# EAGLE design thermostat (EAGLE 7.6.0)
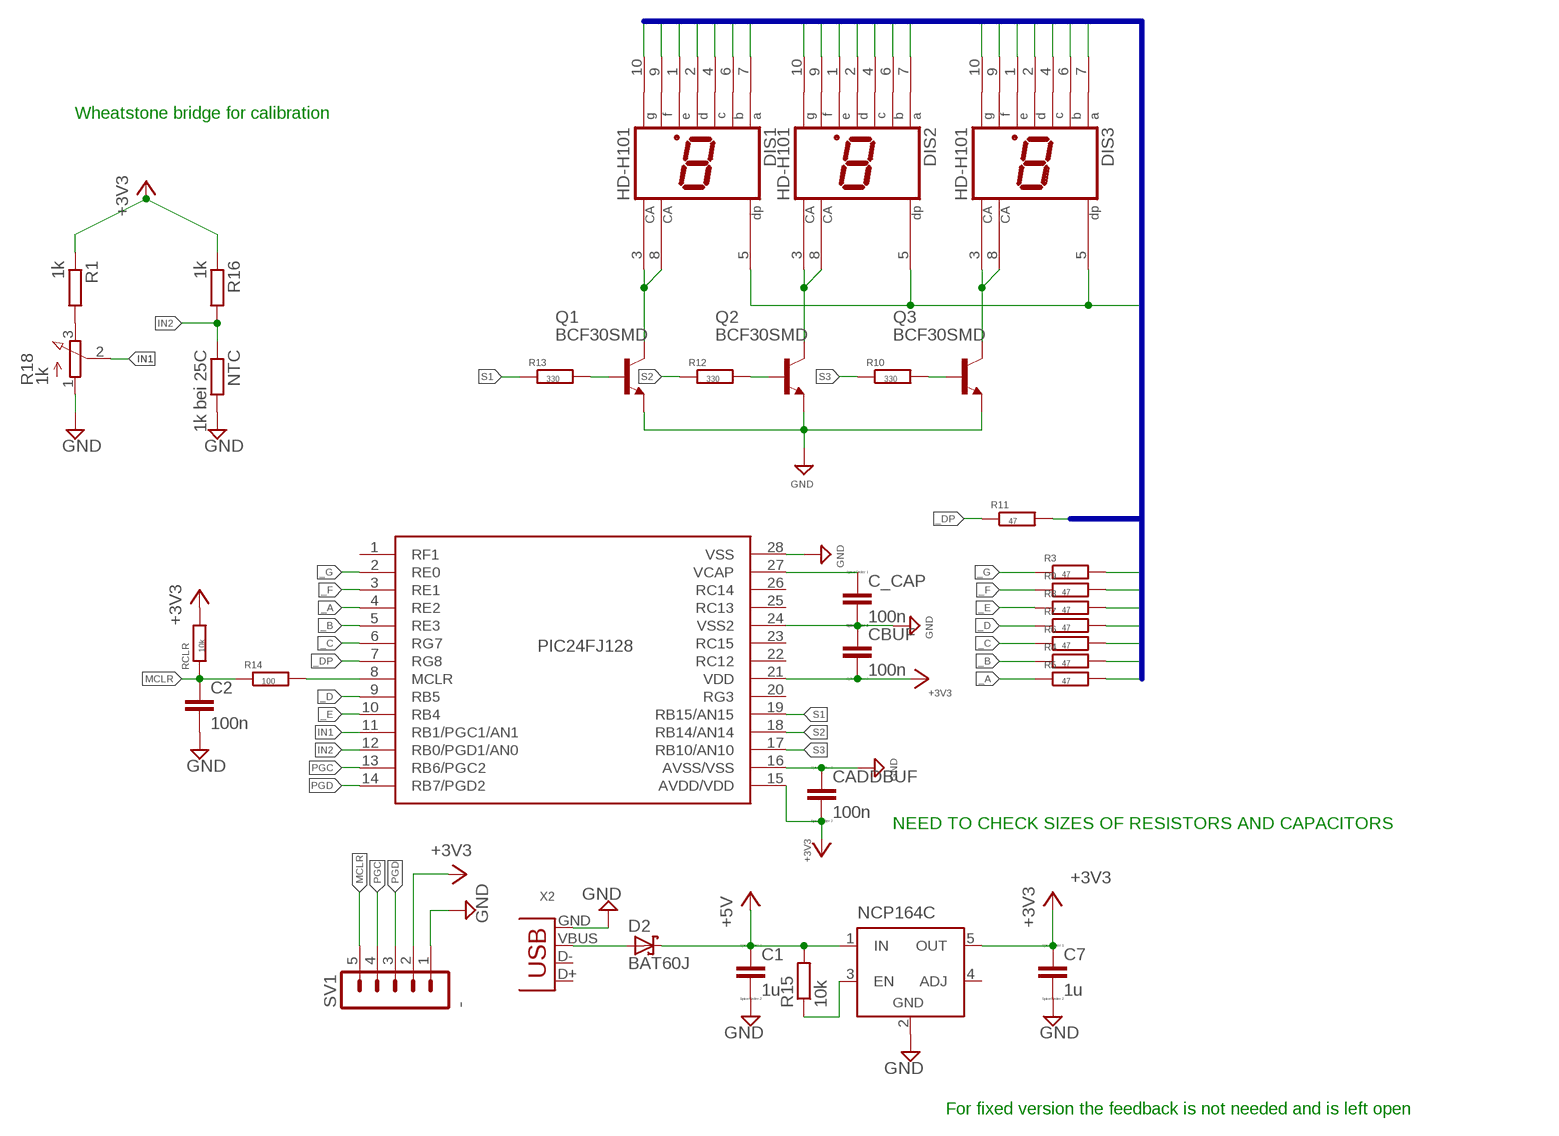
[diagram p0: schematic, sheet 1]

## Parts
C1  1u  CC0603  [C0603]
C2  100n  C-EUC0805  [C0805]
C7  1u  CC0603  [C0603]
C_CAP  100n  CC0603  [C0603]
CADDBUF  100n  CC0603  [C0603]
CBUF  100n  CC0603  [C0603]
D2  BAT60J  [SOD323_ST]
DIS1  HD-H101  [HDSP-M]
DIS2  HD-H101  [HDSP-M]
DIS3  HD-H101  [HDSP-M]
NCP164C  -  NCP164C-5V-3.3V  [TSOP-5]
NTC  1k bei 25C  R-EU_0204/2V  [0204V]
Q1  BCF30SMD  [SOT23-BEC]
Q2  BCF30SMD  [SOT23-BEC]
Q3  BCF30SMD  [SOT23-BEC]
R1  1k  R-EU_R2010  [R2010]
R3  47  R-EU_R0603  [R0603]
R4  47  R-EU_R0603  [R0603]
R5  47  R-EU_R0603  [R0603]
R6  47  R-EU_R0603  [R0603]
R7  47  R-EU_R0603  [R0603]
R8  47  R-EU_R0603  [R0603]
R9  47  R-EU_R0603  [R0603]
R10  330  R-EU_R0603  [R0603]
R11  47  R-EU_R0603  [R0603]
R12  330  R-EU_R0603  [R0603]
R13  330  R-EU_R0603  [R0603]
R14  100  R-EU_R0603  [R0603]
R15  10k  R-EU_R0603  [R0603]
R16  1k  R-EU_R2010  [R2010]
R18  1k  3RP/1610N  [3RP/1610N]
RCLR  10k  R-EU_R0603  [R0603]
SV1  -  MA05-1  [MA05-1]
U$2  -  PIC24FJ128  [SSOP28]
X2  -  USB-A-S  [USB-A-S]

## Nets
+3V3: C7.1 CADDBUF.2 CBUF.2 NCP164C.5(OUT) R1.1 R16.1 RCLR.2 SV1.2 U$2.15(AVDD/VDD) U$2.21(VDD)
+5V: C1.1 D2.C NCP164C.1(IN) R15.2
_A: R5.1 U$2.4(RE2)
_B: R4.1 U$2.5(RE3)
_C: R6.1 U$2.6(RG7)
_D: R7.1 U$2.9(RB5)
_DP: R11.1 U$2.7(RG8)
_E: R8.1 U$2.10(RB4)
_F: R9.1 U$2.3(RE1)
_G: R3.1 U$2.2(RE0)
A: DIS1.7(A) DIS2.7(A) DIS3.7(A) R5.2
B: DIS1.6(B) DIS2.6(B) DIS3.6(B) R4.2
C: DIS1.4(C) DIS2.4(C) DIS3.4(C) R6.2
D: DIS1.2(D) DIS2.2(D) DIS3.2(D) R7.2
DP: DIS1.5(DP) DIS2.5(DP) DIS3.5(DP) R11.2
E: DIS1.1(E) DIS2.1(E) DIS3.1(E) R8.2
F: DIS1.9(F) DIS2.9(F) DIS3.9(F) R9.2
G: DIS1.10(G) DIS2.10(G) DIS3.10(G) R3.2
GND: C1.2 C2.2 C7.2 C_CAP.2 CADDBUF.1 CBUF.1 NCP164C.2(GND) NTC.2 Q1.E Q2.E Q3.E R18.1(A) SV1.1 U$2.16(AVSS/VSS) U$2.24(VSS2) U$2.28(VSS) X2.GND
IN1: R18.2(S) U$2.11(RB1/PGC1/AN1)
IN2: NTC.1 R16.2 U$2.12(RB0/PGD1/AN0)
MCLR: C2.1 R14.1 RCLR.1 SV1.5
N$1: NCP164C.3(EN) R15.1
N$2: R1.2 R18.3(E)
N$4: C_CAP.1 U$2.27(VCAP)
N$6: D2.A X2.VBUS
N$8: R14.2 U$2.8(MCLR)
N$16: DIS1.3(CA) DIS1.8(CA) Q1.C
N$17: DIS2.3(CA) DIS2.8(CA) Q2.C
N$18: DIS3.3(CA) DIS3.8(CA) Q3.C
N$19: Q1.B R13.2
N$20: Q2.B R12.2
N$21: Q3.B R10.2
PGC: SV1.4 U$2.13(RB6/PGC2)
PGD: SV1.3 U$2.14(RB7/PGD2)
S1: R13.1 U$2.19(RB15/AN15)
S2: R12.1 U$2.18(RB14/AN14)
S3: R10.1 U$2.17(RB10/AN10)
Unconnected: NCP164C.4(ADJ) U$2.1(RF1) U$2.20(RG3) U$2.22(RC12) U$2.23(RC15) U$2.25(RC13) U$2.26(RC14) X2.D+ X2.D-

## Buses
A,B,C,D,E,F,G,DP

## Notes on the sheet
- Wheatstone bridge for calibration
- NEED TO CHECK SIZES OF RESISTORS AND CAPACITORS
- For fixed version the feedback is not needed and is left open

## Library data of the parts
C1 C7 C_CAP CADDBUF CBUF = eagle-ltspice:C: CAPACITOR, European symbol; SPICEMODEL: NONE; SPICEPREFIX: C
C2 = rcl:C-EU: CAPACITOR, European symbol
D2 = diode:BAT60J: Schottky barrier diode Source: www.st.com, BAT60J.pdf
DIS1-DIS3 = display-hp:HD-H101: LED DISPLAY 1-character 7 segment, decimal point right; OC_FARNELL: unknown; OC_NEWARK: unknown
NCP164C = linear:NCP164C-5V-3.3V
NTC R1 R16 = resistor:R-EU_: RESISTOR, European symbol
Q1-Q3 = transistor-npn:BCF30*: NPN Transistor
R3-R15 RCLR = rcl:R-EU_: RESISTOR, European symbol
R18 = pot:3RP/1610N: 16mm Potentiometer one level Source: http://www.alphapotentiometers.net/html/16mm_pot_2.html
SV1 = con-lstb:MA05-1: PIN HEADER; OC_FARNELL: unknown; OC_NEWARK: unknown
U$2 = microchip:PIC24FJ128
X2 = con-usb-3:USB: USB Connectors

## Module PIC24
Ports: 

### Library data of the parts

## Board
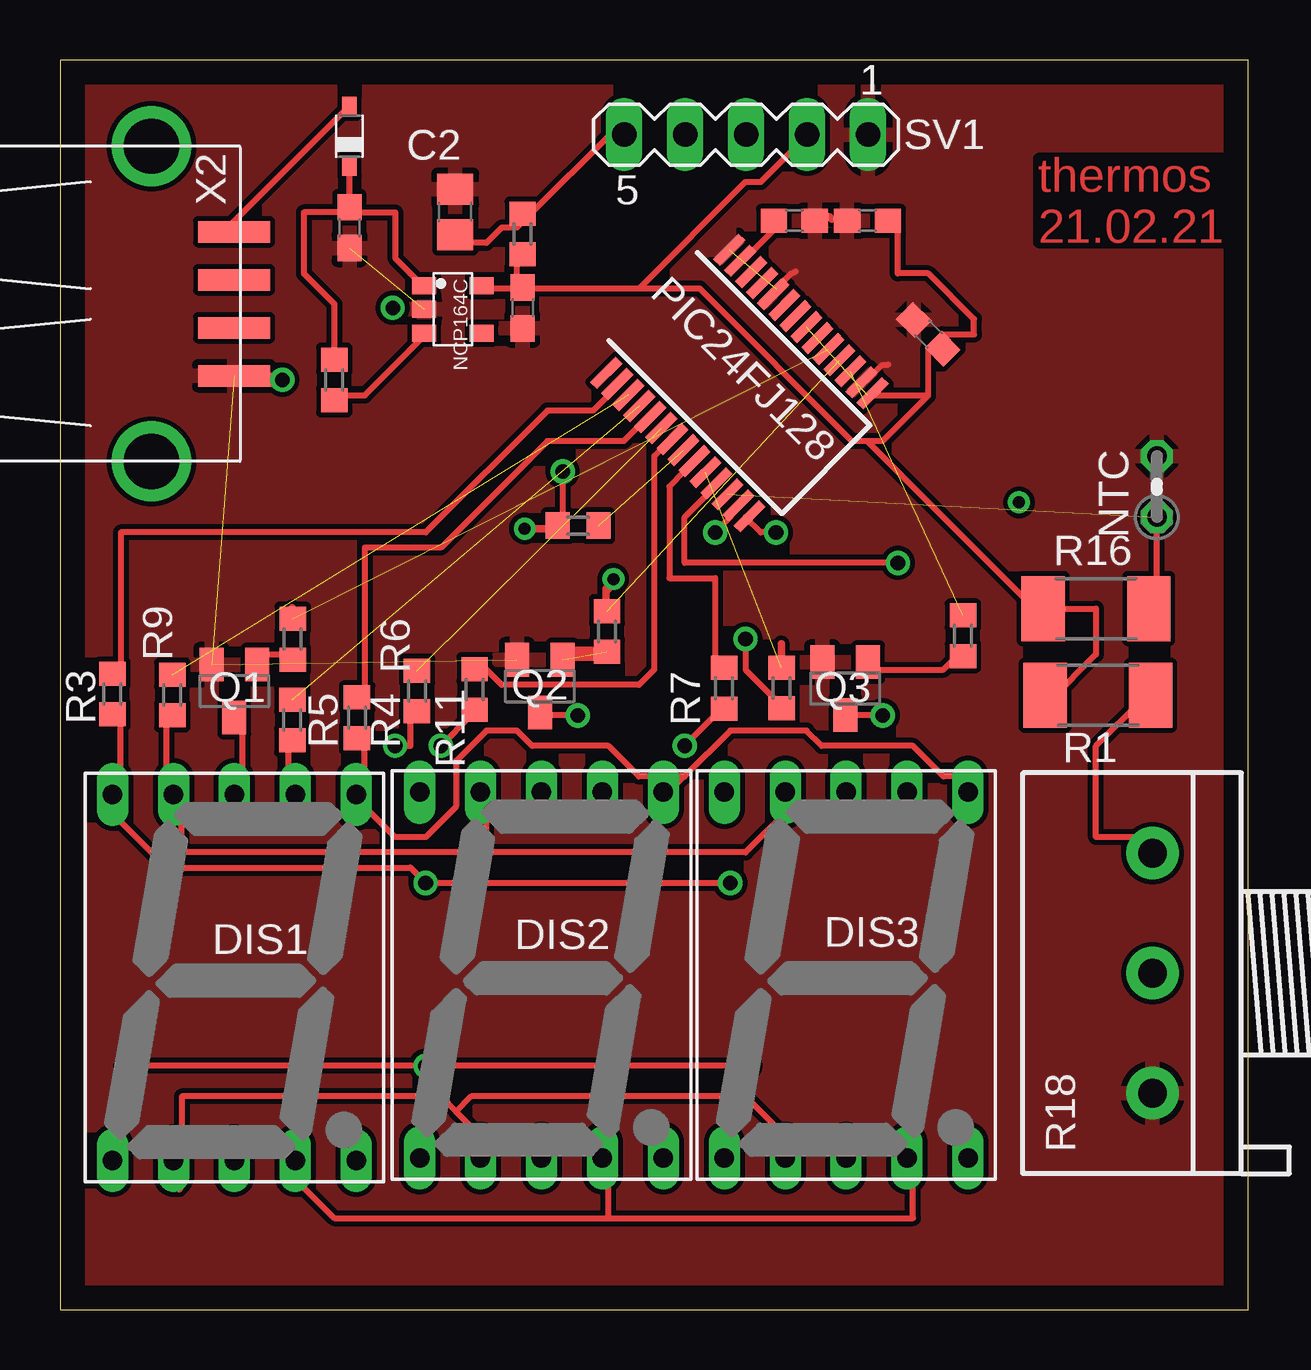
[diagram p1: board, top side]
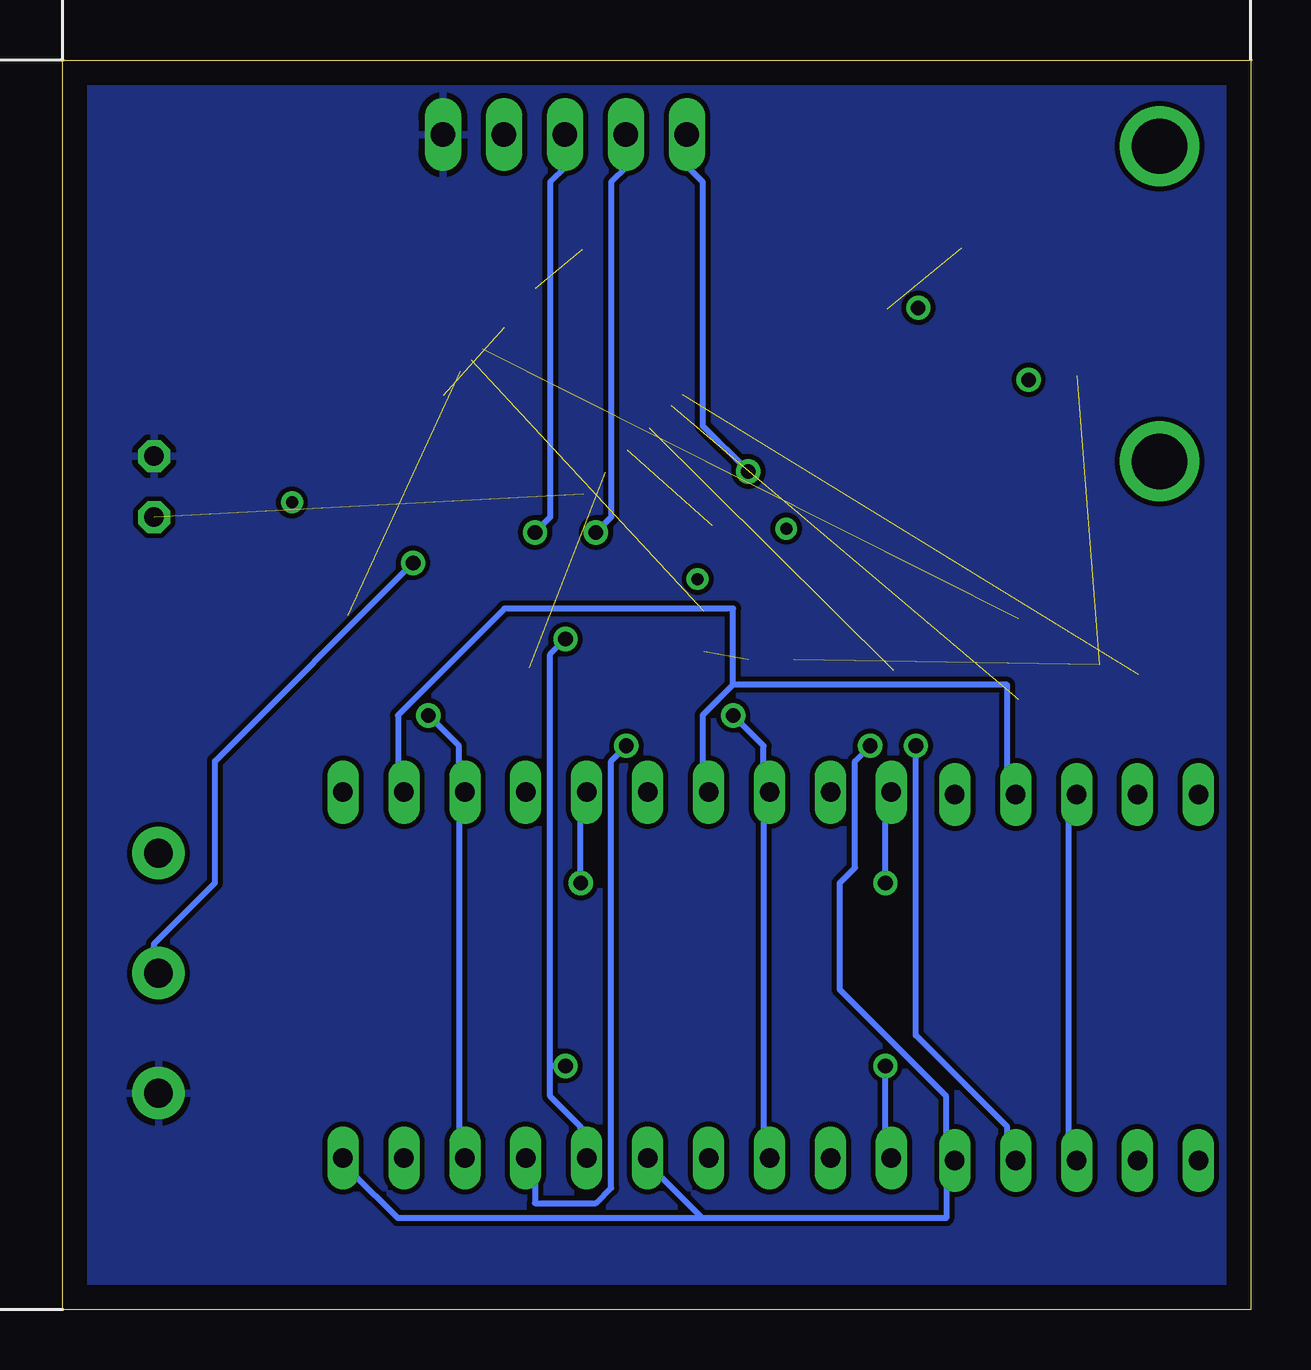
[diagram p2: board, bottom side, seen from below]

Size 49.53 x 52.07 mm. Coordinates in mm from the lower left corner, seen from the top.
Outline: 0,0 49.53,0 49.53,52.07 0,52.07 0,0
Copper layers (1*16): Top 0.035mm / dielectric 1.5mm / Bottom 0.035mm
Design rules "default": minimum track width 10mil, minimum drill 24mil, track to track 8mil, track to pad 8mil, pad to pad 8mil, via to via 8mil, smd to smd 8mil, copper to edge 40mil, drill to drill 8mil, minimum pad ring 10mil, minimum via ring 8mil, stop-mask expansion 4mil, vias tented up to drill 0mil, thermal gap 10mil

### Footprints (pad centres in the part's own frame; a part is rotated, then mirrored left to right if it is on the bottom)
C0603 = smd 1.1 x 1: 1 -0.85,0; 2 0.85,0
C0805 = smd 1.3 x 1.5: 1 -0.95,0; 2 0.95,0
SOD323_ST = smd 0.8 x 0.6: A 1.25,0; C -1.25,0
HDSP-M = drill 0.813 long: 1 -5.08,-7.62; 2 -2.54,-7.62; 3 0,-7.62; 4 2.54,-7.62; 5 5.08,-7.62; 6 5.08,7.62; 7 2.54,7.62; 8 0,7.62; 9 -2.54,7.62; 10 -5.08,7.62
TSOP-5 = smd 0.7 x 1: 1 -0.99,-1.2; 2 0,-1.2; 3 0.99,-1.2; 4 0.99,1.2; 5 -0.99,1.2
0204V = drill 0.813 octagon: 1 -1.27,0; 2 1.27,0
SOT23-BEC = smd 1 x 1.4: B -0.95,-1.1; C 0,1.1; E 0.95,-1.1
R2010 = smd 1.8 x 2.7: 1 -2.2,0; 2 2.2,0
R0603 = smd 1 x 1.1: 1 -0.85,0; 2 0.85,0
3RP/1610N = drill 1.2 pad 2.184: 1 -5,0; 2 0,0; 3 5,0
MA05-1 = drill 1.016 long: 1 -5.08,0; 2 -2.54,0; 3 0,0; 4 2.54,0; 5 5.08,0
SSOP28 = smd 0.4 x 1.5: 1 -4.225,-3.625; 2 -3.575,-3.625; 3 -2.925,-3.625; 4 -2.275,-3.625; 5 -1.625,-3.625; 6 -0.975,-3.625; 7 -0.325,-3.625; 8 0.325,-3.625; 9 0.975,-3.625; 10 1.625,-3.625; 11 2.275,-3.625; 12 2.925,-3.625; 13 3.575,-3.625; 14 4.225,-3.625; 15 4.225,3.625; 16 3.575,3.625; 17 2.925,3.625; 18 2.275,3.625; 19 1.625,3.625; 20 0.975,3.625; 21 0.325,3.625; 22 -0.325,3.625; 23 -0.975,3.625; 24 -1.625,3.625; 25 -2.275,3.625; 26 -2.925,3.625; 27 -3.575,3.625; 28 -4.225,3.625
USB-A-S = smd 3 x 0.9: D+ 3.45,-1; D- 3.45,1; GND 3.45,-3; VBUS 3.45,3 | drill 2.311: P$5 0,-6.566; P$6 0,6.566

### Placement (x,y rotation side)
C1  12.06,45.09 270 top
C2  16.47,45.74 90 top
C7  19.28,41.74 270 top
C_CAP  30.61,45.37 0 top
CADDBUF  36.2,40.64 315 top
CBUF  33.66,45.37 0 top
D2  12.06,48.89 90 top
DIS1  7.27,13.84 0 top
DIS2  20.07,13.94 0 top
DIS3  32.77,13.94 0 top
NCP164C  16.38,41.68 270 top
NTC  45.72,34.29 90 top
Q1  7.27,25.78 180 top
Q2  20,25.98 180 top
Q3  32.73,25.88 180 top
R1  43.26,25.6 0 top
R3  2.18,25.65 270 top
R4  12.38,24.66 270 top
R5  9.68,24.57 270 top
R6  14.88,25.78 270 top
R7  27.68,25.89 270 top
R8  30.08,25.9 270 top
R9  4.68,25.61 270 top
R10  37.64,28.08 270 top
R11  17.28,25.84 270 top
R12  22.8,28.26 270 top
R13  9.7,27.94 270 top
R14  21.59,32.67 0 top
R15  11.43,38.73 90 top
R16  43.18,29.21 0 top
R18  45.54,14.02 90 top
RCLR  19.28,44.82 270 top
SV1  28.6,48.96 180 top
U$2  28.32,38.61 315 top
X2  3.81,41.91 0 top

### Tracks (layer width: path | path; a pad name or v marks a point on that pad's centre or on a via)
+3V3  (1 unrouted)
  Top 0.254: R1.1 41.28,25.4 43.18,27.3 43.18,29.21 R16.1 40.64,29.21 33.66,36.2 | 19.05,42.55 17.78,42.55 NCP164C.5 | 19.05,42.55 19.05,43.81 RCLR.2 | 19.05,42.55 C7.1 19.68,42.55 24.13,42.55 | 36.2,38.1 36.2,40.01 CADDBUF.2 36.83,40.64 38.1,40.64 38.1,41.27 36.2,43.18 34.93,43.18 34.93,45.09 CBUF.2 | 36.2,38.1 33.66,38.1 U$2.15 | 24.13,42.55 26.67,42.55 33.02,36.2 33.66,36.2 | 33.66,36.2 34.29,36.2 36.2,38.1 | 24.13,42.55 28.57,46.99 29.21,46.99 31.11,48.89 SV1.2
+5V
  Top 0.254: D2.C C1.1 12.06,45.72 | 12.06,45.72 13.97,45.72 13.97,43.81 15.24,42.55 NCP164C.1 | R15.2 11.43,41.91 10.16,43.18 10.16,45.72 12.06,45.72
_A  (1 unrouted)
_B
  Top 0.254: R4.1 12.7,25.4 12.7,31.75 15.88,31.75 20.32,36.2 23.5,36.2 24.13,36.83 U$2.5
_C  (1 unrouted)
_D
  Top 0.254: R7.1 27.3,26.67 27.3,30.48 25.4,30.48 25.4,34.29 26.04,34.92 U$2.9
_DP
  Top 0.254: R11.1 17.78,26.67 18.41,26.04 24.13,26.04 24.77,26.67 24.77,35.56 25.4,36.2 U$2.7
_E  (1 unrouted)
_F  (1 unrouted)
_G
  Top 0.254: R3.1 2.54,26.67 2.54,32.38 15.24,32.38 20.32,37.46 22.22,37.46 22.86,38.1 U$2.2
A
  Top 0.254: R5.2 9.53,23.49 9.53,21.59 DIS1.7
  Bottom 0.254: 21.59,26.04 22.86,24.77 22.86,21.59 DIS2.7 | 21.59,26.04 10.16,26.04 10.16,21.59 DIS1.7 | 21.59,26.04 21.59,29.21 31.11,29.21 35.56,24.77 35.56,21.59 DIS3.7
B
  Top 0.254: R4.2 12.7,23.49 12.7,21.59 DIS1.6 12.7,20.95 13.97,19.68 15.24,19.68 16.51,20.95 16.51,22.86 17.78,24.13 19.05,24.13 19.68,23.49 22.86,23.49 24.13,22.22 26.04,22.22 | 26.04,22.22 27.94,24.13 31.11,24.13 31.75,23.49 35.56,23.49 36.83,22.22 37.47,22.22 38.1,21.59 DIS3.6 | 26.04,22.22 25.4,21.59 DIS2.6
C  (via drill 0.61)
  Top 0.254: v13.97,23.49 14.61,23.49 14.61,24.77 R6.2 | 22.86,3.81 22.86,5.71 DIS2.4 | 22.86,3.81 11.43,3.81 9.53,5.71 DIS1.4 | 22.86,3.81 35.56,3.81 35.56,5.71 DIS3.4
  Bottom 0.254: v13.97,23.49 13.97,11.43 10.16,7.62 10.16,6.35 DIS1.4
D  (via drill 0.61)
  Top 0.254: 16.51,8.25 17.14,7.62 17.14,6.35 DIS2.2 | 16.51,8.25 15.88,8.89 5.08,8.89 5.08,6.35 DIS1.2 | v26.04,23.49 27.3,24.77 R7.2 | 16.51,8.25 17.14,8.89 28.57,8.89 29.84,7.62 29.84,6.35 DIS3.2
  Bottom 0.254: v26.04,23.49 26.67,22.86 26.67,5.08 27.3,4.45 29.84,4.45 29.84,5.71 DIS3.2
DP  (via drill 0.61)
  Top 0.254: v15.88,23.49 17.14,24.77 R11.2
  Bottom 0.254: v15.88,23.49 16.51,22.86 16.51,18.41 17.14,17.78 17.14,13.34 12.7,8.89 12.7,6.35 DIS1.5 12.7,5.71 12.7,3.81 22.86,3.81 | 22.86,3.81 24.77,5.71 DIS2.5 | 22.86,3.81 35.56,3.81 37.47,5.71 DIS3.5
E  (via drill 0.61)
  Top 0.254: DIS1.1 2.54,6.35 2.54,10.16 v15.24,10.16 v28.57,10.16 | v28.57,27.94 28.57,26.67 29.84,25.4 R8.2
  Bottom 0.254: v15.24,10.16 15.24,6.35 DIS2.1 | v28.57,27.94 29.21,27.3 29.21,10.16 | 29.21,10.16 29.21,8.89 27.94,7.62 27.94,6.35 DIS3.1 | 29.21,10.16 v28.57,10.16
F
  Top 0.254: R9.2 4.45,24.77 4.45,21.59 DIS1.9 5.08,20.95 5.08,19.05 17.78,19.05 | 17.78,19.05 17.78,20.95 DIS2.9 | 17.78,19.05 28.57,19.05 30.48,20.95 DIS3.9
G  (via drill 0.61)
  Top 0.254: R3.2 2.54,24.77 2.54,21.59 DIS1.10 1.91,20.95 4.45,18.41 14.61,18.41 v15.24,17.78 v27.94,17.78
  Bottom 0.254: v15.24,17.78 15.24,20.95 DIS2.10 | v27.94,17.78 27.94,20.95 DIS3.10
GND  (4 unrouted)
  Top 0.254: U$2.16 33.66,38.73 34.29,39.37 34.53,39.38 | U$2.24 29.84,42.55 30.48,43.18 30.66,43.25
  pour Bottom: 0,0 0,52.07 49.53,52.07 49.53,0
  pour Top: -1.27,53.34 50.8,53.34 50.8,-1.27 -1.27,-1.27
IN1  (via drill 0.61)
  Top 0.254: v34.93,31.11 26.04,31.11 26.04,33.02 27.3,34.29 U$2.11
  Bottom 0.254: v34.93,31.11 43.18,22.86 43.18,17.78 45.72,15.24 45.72,14.61 R18.2
IN2  (1 unrouted)
  Top 0.254: NTC.1 45.72,29.21 R16.2
MCLR  (via drill 0.61)
  Top 0.254: 19.68,45.72 22.86,48.89 23.5,48.89 SV1.5 | v20.95,34.92 20.95,33.02 R14.1 | 19.68,45.72 19.05,45.09 18.41,45.09 17.78,44.45 16.51,44.45 C2.1 | 19.68,45.72 RCLR.1
  Bottom 0.254: v20.95,34.92 22.86,36.83 22.86,46.99 23.5,47.62 23.5,48.89 SV1.5
N$1
  Top 0.254: NCP164C.3 15.24,40.64 12.7,38.1 11.43,38.1 R15.1
N$2
  Top 0.254: R1.2 45.09,25.4 43.18,23.49 43.18,19.68 45.09,19.68 45.72,19.05 R18.3
N$4
  Top 0.254: C_CAP.1 29.84,45.09 28.57,43.81 U$2.27
N$6
  Top 0.254: D2.A 12.06,50.16 6.98,45.09 X2.VBUS
N$8  (1 unrouted)
N$9  (via drill 0.6)
  other vias: 13.87,41.74
N$16
  Top 0.254: Q1.C 7.62,24.13 7.62,21.59 DIS1.8
  Bottom 0.254: DIS1.3 7.62,6.35 7.62,20.95 DIS1.8
N$17  (via drill 0.61)
  Top 0.254: v21.59,24.77 20.32,24.77 Q2.C
  Bottom 0.254: v21.59,24.77 20.32,23.49 20.32,21.59 DIS2.8 20.32,20.95 20.32,6.35 DIS2.3
N$18  (via drill 0.61)
  Top 0.254: v34.29,24.77 33.02,24.77 Q3.C
  Bottom 0.254: v34.29,24.77 33.02,23.49 33.02,21.59 DIS3.8 33.02,20.95 33.02,6.35 DIS3.3
N$19
  Top 0.254: R13.2 9.53,27.3 8.26,27.3 Q1.B
N$20  (1 unrouted)
N$21
  Top 0.254: R10.2 37.47,27.3 36.83,26.67 33.66,26.67 Q3.B
N$29
  Top 0.406: 7.87,38.74 7.97,38.74 8.37,38.74
  Top 0.61: 7.97,38.74 9.37,38.74
N$32
  Top 0.254: 21.27,27.24 22.37,27.24
N$35
  Top 0.61: 21.27,27.34 22.57,27.34
N$46  (via drill 0.6)
  other vias: 9.27,38.74
N$51
  Top 0.813: 45.57,24.64 45.67,24.74
N$52
  Top 0.813: 40.97,26.44 40.87,26.34
N$56
  Top 0.305: 17.37,27.04 17.27,26.94
N$58
  Top 0.305: 32.07,45.54 32.17,45.44
N$69
  Top 0.305: 4.97,5.14 4.97,5.04
N$72
  Bottom 0.406: 22.57,20.54 22.67,20.64
N$76
  Bottom 0.406: 22.67,20.54 22.67,20.44
N$82
  Top 0.305: 22.77,32.54 22.77,32.64
N$90  (via drill 0.5 pad 0.25)
  other vias: 23.07,30.44
N$93
  Top 0.305: 22.77,29.34 22.77,29.94 | 22.77,29.94 23.07,30.24 | 22.77,29.94 22.77,30.04 23.27,30.54
N$97  (via drill 0.5 pad 0.25)
  other vias: 39.97,33.64
N$112
  Top 0.305: 9.67,29.14 9.67,29.24
N$116
  Top 0.305: 30.07,27.14 30.07,27.74
N$118  (via drill 0.5 pad 0.25)
  Top 0.305: v19.37,32.54 20.57,32.54
PGC  (via drill 0.61)
  Top 0.254: v27.3,32.38 27.94,33.02 U$2.13
  Bottom 0.254: v27.3,32.38 26.67,33.02 26.67,46.99 26.04,47.62 26.04,48.89 SV1.4
PGD  (via drill 0.61)
  Top 0.254: v29.84,32.38 29.21,32.38 28.57,33.02 U$2.14
  Bottom 0.254: v29.84,32.38 29.21,33.02 29.21,46.99 28.57,47.62 28.57,48.89 SV1.3
S1  (1 unrouted)
S2  (1 unrouted)
S3  (1 unrouted)

### Text on the board
Top: thermos / 21.02.21